# Altium schematic sheet H-brigde_connector.SchDoc
size A
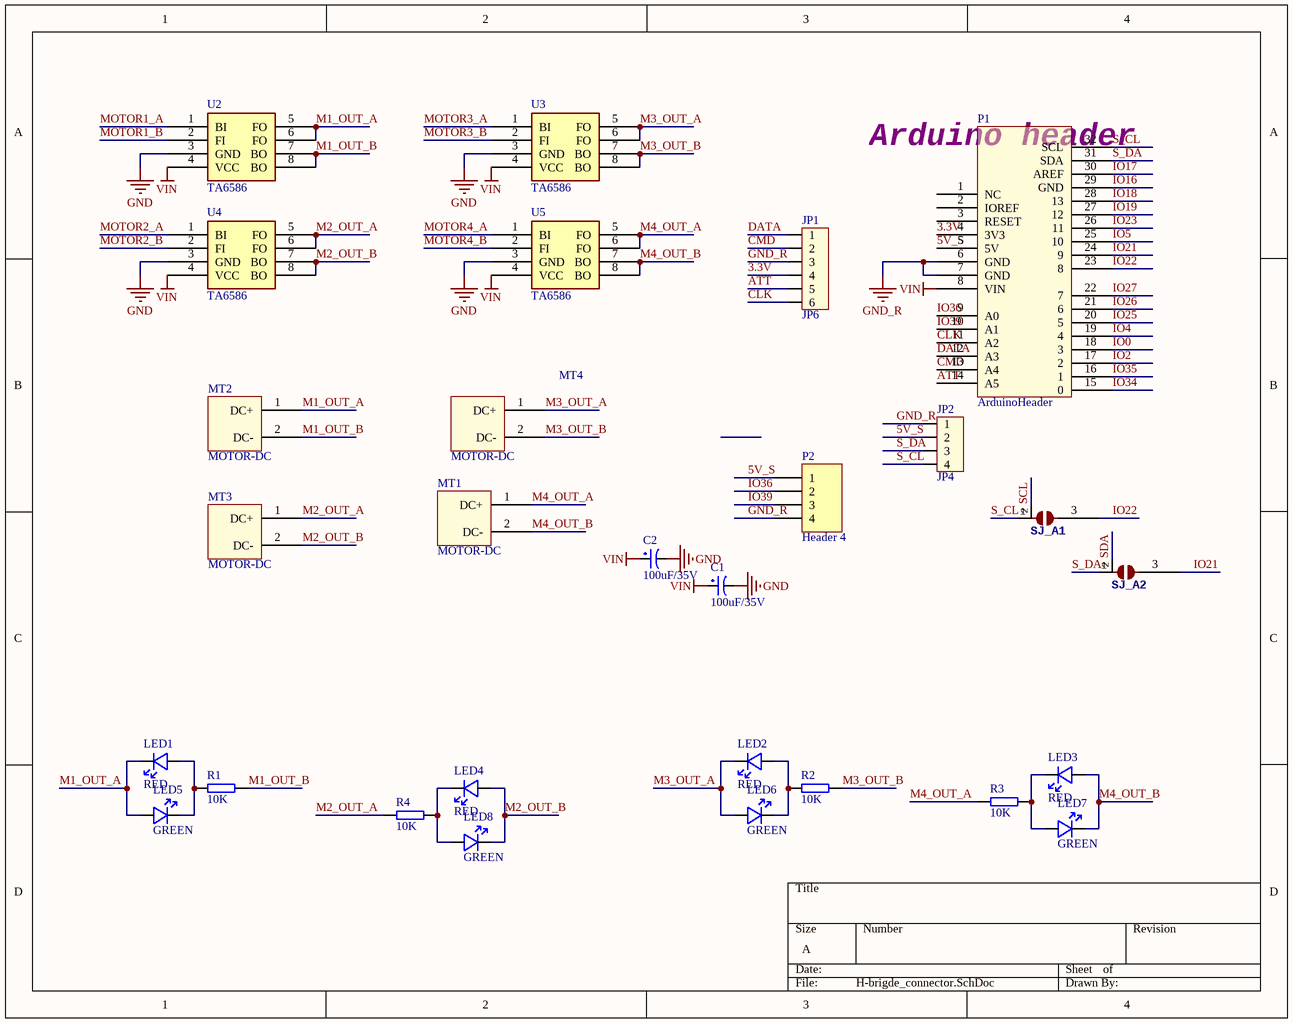
[diagram p0: H-brigde_connector.SchDoc]

## Parts
C1  100uF/35V  [CP1.5/3.4]
C2  100uF/35V  [CP1.5/3.4]
JP1  JP6  [CON6]
JP2  JP4  [CONN-TH_XH2.54-4AW]
LED1  RED  [SMT0603P]
LED2  RED  [SMT0603P]
LED3  RED  [SMT0603P]
LED4  RED  [SMT0603P]
LED5  GREEN  [SMT0603P]
LED6  GREEN  [SMT0603P]
LED7  GREEN  [SMT0603P]
LED8  GREEN  [SMT0603P]
MT1  MOTOR-DC  [CON2-5.08DC]
MT2  MOTOR-DC  [CON2-5.08DC]
MT3  MOTOR-DC  [CON2-5.08DC]
MT4  MOTOR-DC  [CON2-5.08DC]
P1  ArduinoHeader  [ArduinoClone2]
P2  Header 4  [HDR1X4]
R1  value 10K  [SMT0603]  (hidden comment: Resistor)
R2  value 10K  [SMT0603]  (hidden comment: Resistor)
R3  value 10K  [SMT0603]  (hidden comment: Resistor)
R4  value 10K  [SMT0603]  (hidden comment: Resistor)
SJ_A1  SOLDERJUMPERREFLOW_NOPASTE  [SOLDERJUMPER_REFLOW_NOPASTE]  (value not drawn)
SJ_A2  SOLDERJUMPERREFLOW_NOPASTE  [SOLDERJUMPER_REFLOW_NOPASTE]  (value not drawn)
U2  TA6586  [DIP.100/8/W.300/L.400]
U3  TA6586  [DIP.100/8/W.300/L.400]
U4  TA6586  [DIP.100/8/W.300/L.400]
U5  TA6586  [DIP.100/8/W.300/L.400]

## Nets
GND: C1.2 C2.2 U2.3(GND) U3.3(GND) U4.3(GND) U5.3(GND)
GND_R: JP1.3 JP2.1 P1.6(GND) P1.7(GND) P2.4
VIN: C1.1 C2.1 P1.8(VIN) U2.4(VCC) U3.4(VCC) U4.4(VCC) U5.4(VCC)
3.3V: JP1.4 P1.4(3V3)
5V_S: JP2.2 P1.5(5V) P2.1
ATT: JP1.5 P1.14(A5)
CLK: JP1.6 P1.11(A2)
CMD: JP1.2 P1.13(A4)
DATA: JP1.1 P1.12(A3)
IO0: P1.18(3)
IO2: P1.17(2)
IO4: P1.19(4)
IO5: P1.25(10)
IO16: P1.29(GND)
IO17: P1.30(AREF)
IO18: P1.28(13)
IO19: P1.27(12)
IO21: P1.24(9) SJ_A2.3
IO22: P1.23(8) SJ_A1.3
IO23: P1.26(11)
IO25: P1.20(5)
IO26: P1.21(6)
IO27: P1.22(7)
IO34: P1.15(0)
IO35: P1.16(1)
IO36: P1.9(A0) P2.2
IO39: P1.10(A1) P2.3
M1_OUT_A: LED1.2 LED5.1 MT2.1(DC+) U2.5(FO) U2.6(FO)
M1_OUT_B: MT2.2(DC-) R1.2 U2.7(BO) U2.8(BO)
M2_OUT_A: MT3.1(DC+) R4.1 U4.5(FO) U4.6(FO)
M2_OUT_B: LED4.1 LED8.2 MT3.2(DC-) U4.7(BO) U4.8(BO)
M3_OUT_A: LED2.2 LED6.1 MT4.1(DC+) U3.5(FO) U3.6(FO)
M3_OUT_B: MT4.2(DC-) R2.2 U3.7(BO) U3.8(BO)
M4_OUT_A: MT1.1(DC+) R3.1 U5.5(FO) U5.6(FO)
M4_OUT_B: LED3.1 LED7.2 MT1.2(DC-) U5.7(BO) U5.8(BO)
MOTOR1_A: U2.1(BI)
MOTOR1_B: U2.2(FI)
MOTOR2_A: U4.1(BI)
MOTOR2_B: U4.2(FI)
MOTOR3_A: U3.1(BI)
MOTOR3_B: U3.2(FI)
MOTOR4_A: U5.1(BI)
MOTOR4_B: U5.2(FI)
S_CL: JP2.4 P1.32(SCL) SJ_A1.1
S_DA: JP2.3 P1.31(SDA) SJ_A2.1
SCL: SJ_A1.2
SDA: SJ_A2.2
NetLED1_1: LED1.1 LED5.2 R1.1
NetLED2_1: LED2.1 LED6.2 R2.1
NetLED3_2: LED3.2 LED7.1 R3.2
NetLED4_2: LED4.2 LED8.1 R4.2

Not connected (* = marked no-connect by the designer): P1 1(NC) 2(IOREF) 3(RESET)

## Notes on the sheet
- (near P1) Arduino header

## Library data of the parts
C1 C2 = CP3: Cap 100uF/35V - 470uF/16V; Value: 100uF/35V/50V; Description 1: 1000uF/6,3V - 470uF/16V - 330uF - 25V; Description 2: 220uF/35V - 100uF/50V - 63V - 4,7uF/200V; Description 3: 22uF => 33uF100V - 3,3uF => 4,7uF/250V; Description 4: 2,2uF =>3,3uF/350 - 2,2uF/400V - 1uF/450V
JP1 = Con6: Connector 6; Value: Connector 6
JP2 = Con4: Connector 4; Value: Connector 4
LED1-LED4 = LNJ237W82RA: LED SM 0603 RED 1V95 FWD VOLTAGE; Supplier 1: Digi-Key; Forward Voltage: 1V95; Supplier Part Number 1: LNJ237W82RACT-ND
LED5-LED8 = LNJ337W83RA: LED SM 0603 GREEN 1V95 FWD VOLTAGE; Supplier 1: Digi-Key; Forward Voltage: 1V95; Supplier Part Number 1: LNJ337W83RACT-ND
P2 = Header 4: Header, 4-Pin; LatestRevisionDate: 17-Jul-2002; LatestRevisionNote: Re-released for DXP Platform.; Publisher: Altium Limited
R1-R4 = RES-SM-0603-10K: RES SM 0603 10K; Supplier 1: Farnell; Supplier 2: Digi-Key; Supplier Part Number 1: 9330399; Supplier Part Number 2: 541-10.0KHCT-ND
SJ_A1 SJ_A2 = SOLDERJUMPERREFLOW_NOPASTE: SMD Solder JUMPER   Solder the two pads together to create a connection, or remove the solder to break it.REFLOW - Use this footprint for solder paste and reflow ovens. WAVE - Use this footprint for hand-soldering (larger pads).    CLOSED - Has a trace between the two pads to ensure it is closed by default.  The trace needs to be cut to disable the jumper, and can be closed again by creating a solder bridge between the two pads.